# Altium schematic sheet PM12_CONN.SchDoc: FIT_PM12 board
size 420 x 297 mm; CheckedBy: G.Kasprowicz; Author: INR Moscow; CompanyName: WUT ISE; DrawnBy: M.Podgórski; Organization: WUT ISE; Address1: PW ISE; Address2: Nowowiejska 15/19 00-665 Warsaw; Address3: gkasprow@gmail.com; DocumentNumber: 13; Revision: 2; SheetNumber: 4; SheetTotal: 34; ModifiedBy: -; CheckedDate: -; Title2: Serial, SFP; DivGrp: WUT ISE; Designer: INR RAS; ModifiedDate: -; ProjectName: Sensor Box
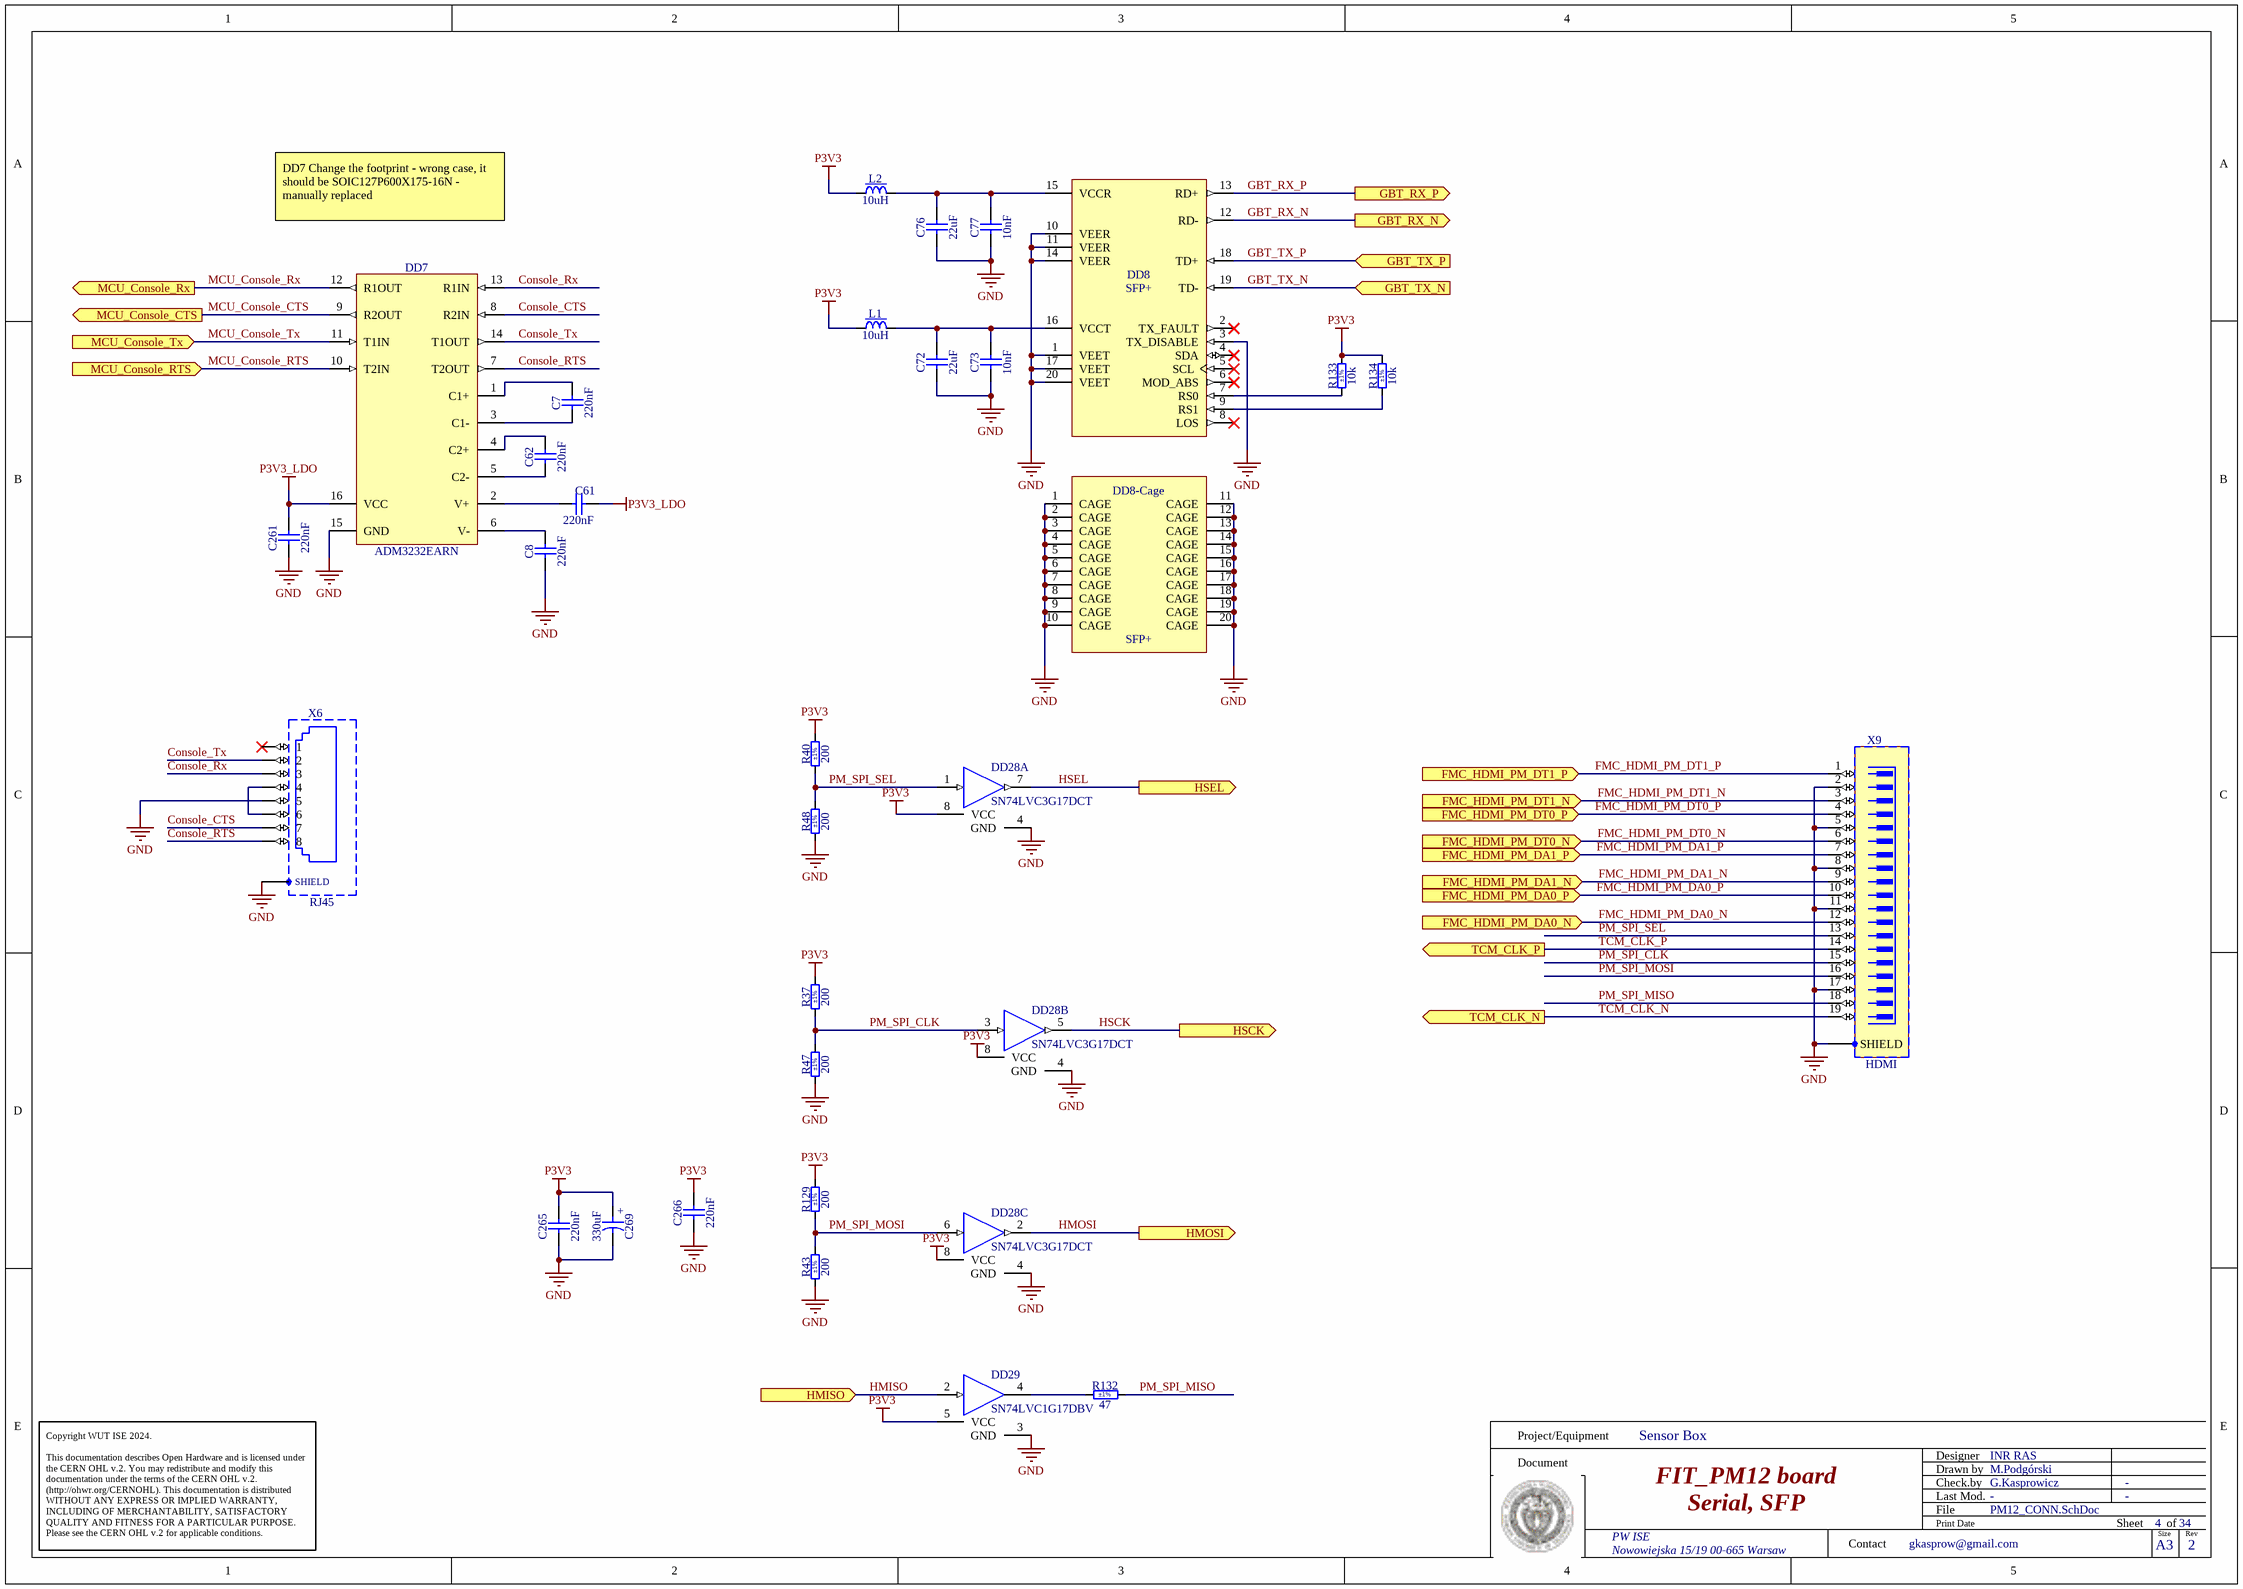
[diagram p0: PM12_CONN.SchDoc]

## Parts
C7  220nF  [CAPC2012X135N]
C8  220nF  [CAPC2012X135N]
C61  220nF  [CAPC2012X135N]
C62  220nF  [CAPC2012X135N]
C72  22uF  [CAPC3216X180N]
C73  10nF  [CAPC2012X135N]
C76  22uF  [CAPC3216X180N]
C77  10nF  [CAPC2012X135N]
C261  220nF  [CAPC2012X135N]
C265  220nF  [CAPC2012X135N]
C266  220nF  [CAPC2012X135N]
C269  330uF  [CAPMP7343X310N]
DD7  ADM3232EARN  [SOIC127P600X175-16N]
DD8  SFP+  [AMPHENOL_UE76A203000]
DD8-Cage  SFP+  [AMPHENOL_U77A16131001]
DD28  SN74LVC3G17DCT  [SOP65P400X130-8N]  (parts A,B,C of 3)
DD29  SN74LVC1G17DBV  [SOT95P280X145-5N]
L1  10uH  [INDM5552X200N]
L2  10uH  [INDM5552X200N]
R37  200  Tolerance: ±1%  [RESC2012X60N]
R40  200  Tolerance: ±1%  [RESC2012X60N]
R43  200  Tolerance: ±1%  [RESC2012X60N]
R47  200  Tolerance: ±1%  [RESC2012X60N]
R48  200  Tolerance: ±1%  [RESC2012X60N]
R129  200  Tolerance: ±1%  [RESC2012X60N]
R132  47  Tolerance: ±1%  [RESC2012X60N]
R133  10k  Tolerance: ±1%  [RESC2012X60N]
R134  10k  Tolerance: ±1%  [RESC2012X60N]
X6  RJ45  [AMPHENOL_RJLSE4238101]
X9  HDMI  [MOLEX_47151-0001]

## Ports
FMC_HDMI_PM_DA0_N (in), FMC_HDMI_PM_DA0_P (in), FMC_HDMI_PM_DA1_N (in), FMC_HDMI_PM_DA1_P (in), FMC_HDMI_PM_DT0_N (in), FMC_HDMI_PM_DT0_P (in), FMC_HDMI_PM_DT1_N (in), FMC_HDMI_PM_DT1_P (in), GBT_RX_N (out), GBT_RX_P (out), GBT_TX_N (in), GBT_TX_P (in), HMISO (in), HMOSI (out), HSCK (out), HSEL (out), MCU_Console_CTS (out), MCU_Console_RTS (in), MCU_Console_Rx (out), MCU_Console_Tx (in), TCM_CLK_N (out), TCM_CLK_P (out)

## Nets
GND: C8.1 C72.1 C73.1 C76.1 C77.1 C261.1 C265.1 C266.1 C269.2 DD7.15(GND) DD8.1(VEET) DD8.3(TX_DISABLE) DD8.10(VEER) DD8.11(VEER) DD8.14(VEER) DD8.17(VEET) DD8.20(VEET) DD8-Cage.1(CAGE) DD8-Cage.2(CAGE) DD8-Cage.3(CAGE) DD8-Cage.4(CAGE) DD8-Cage.5(CAGE) DD8-Cage.6(CAGE) DD8-Cage.7(CAGE) DD8-Cage.8(CAGE) DD8-Cage.9(CAGE) DD8-Cage.10(CAGE) DD8-Cage.11(CAGE) DD8-Cage.12(CAGE) DD8-Cage.13(CAGE) DD8-Cage.14(CAGE) DD8-Cage.15(CAGE) DD8-Cage.16(CAGE) DD8-Cage.17(CAGE) DD8-Cage.18(CAGE) DD8-Cage.19(CAGE) DD8-Cage.20(CAGE) DD28.4(GND) DD29.3(GND) R43.1 R47.1 R48.1 X6.5 X6.SHIELD X9.2 X9.5 X9.8 X9.11 X9.17 X9.SHIELD
P3V3: C265.2 C266.2 C269.1 DD28.8(VCC) DD29.5(VCC) L1.1 L2.1 R37.2 R40.2 R129.2 R133.2 R134.2
P3V3_LDO: C61.2 C261.2 DD7.16(VCC)
Console_CTS: DD7.8(R2IN) X6.7
Console_RTS: DD7.7(T2OUT) X6.8
Console_Rx: DD7.13(R1IN) X6.3
Console_Tx: DD7.14(T1OUT) X6.2
FMC_HDMI_PM_DA0_N: X9.12 ; port FMC_HDMI_PM_DA0_N
FMC_HDMI_PM_DA0_P: X9.10 ; port FMC_HDMI_PM_DA0_P
FMC_HDMI_PM_DA1_N: X9.9 ; port FMC_HDMI_PM_DA1_N
FMC_HDMI_PM_DA1_P: X9.7 ; port FMC_HDMI_PM_DA1_P
FMC_HDMI_PM_DT0_N: X9.6 ; port FMC_HDMI_PM_DT0_N
FMC_HDMI_PM_DT0_P: X9.4 ; port FMC_HDMI_PM_DT0_P
FMC_HDMI_PM_DT1_N: X9.3 ; port FMC_HDMI_PM_DT1_N
FMC_HDMI_PM_DT1_P: X9.1 ; port FMC_HDMI_PM_DT1_P
GBT_RX_N: DD8.12(RD-) ; port GBT_RX_N
GBT_RX_P: DD8.13(RD+) ; port GBT_RX_P
GBT_TX_N: DD8.19(TD-) ; port GBT_TX_N
GBT_TX_P: DD8.18(TD+) ; port GBT_TX_P
HMISO: DD29.2(IN) ; port HMISO
HMOSI: DD28.2(OUT) ; port HMOSI
HSCK: DD28.5(OUT) ; port HSCK
HSEL: DD28.7(OUT) ; port HSEL
MCU_Console_CTS: DD7.9(R2OUT) ; port MCU_Console_CTS
MCU_Console_RTS: DD7.10(T2IN) ; port MCU_Console_RTS
MCU_Console_Rx: DD7.12(R1OUT) ; port MCU_Console_Rx
MCU_Console_Tx: DD7.11(T1IN) ; port MCU_Console_Tx
PM_SPI_CLK: DD28.3(IN) R37.1 R47.2 X9.15
PM_SPI_MISO: R132.2 X9.18
PM_SPI_MOSI: DD28.6(IN) R43.2 R129.1 X9.16
PM_SPI_SEL: DD28.1(IN) R40.1 R48.2 X9.13
TCM_CLK_N: X9.19 ; port TCM_CLK_N
TCM_CLK_P: X9.14 ; port TCM_CLK_P
NetC7_1: C7.1 DD7.3(C1-)
NetC7_2: C7.2 DD7.1(C1+)
NetC8_2: C8.2 DD7.6(V-)
NetC61_1: C61.1 DD7.2(V+)
NetC62_1: C62.1 DD7.5(C2-)
NetC62_2: C62.2 DD7.4(C2+)
NetC72_2: C72.2 C73.2 DD8.16(VCCT) L1.2
NetC76_2: C76.2 C77.2 DD8.15(VCCR) L2.2
NetDD8_7: DD8.7(RS0) R133.1
NetDD8_9: DD8.9(RS1) R134.1
NetDD29_4: DD29.4(OUT) R132.1
NetX6_4: X6.4 X6.6

Not connected (* = marked no-connect by the designer): DD8 2(TX_FAULT)* 4(SDA)* 5(SCL)* 6(MOD_ABS)* 8(LOS)*; X6 1*

## Notes on the sheet
- DD7 Change the footprint - wrong case, it should be SOIC127P600X175-16N - manually replaced
- Project/Equipment
- Document
- Designer
- Drawn by
- Check.by
- Copyright WUT ISE 2024.
  This documentation describes Open Hardware and is licensed under the CERN OHL v.2. You may redistribute and modify this documentation under the terms of the CERN OHL v.2. (http://ohwr.org/CERNOHL). This documentation is distributed WITHOUT ANY EXPRESS OR IMPLIED WARRANTY, INCLUDING OF MERCHANTABILITY, SATISFACTORY QUALITY AND FITNESS FOR A PARTICULAR PURPOSE. Please see the CERN OHL v.2 for applicable conditions.
- Contact
- File
- Last Mod.
- Print Date
- Sheet
- Size
- A3
- of
- Rev
- (in symbol CTE7343-31_330UF_6.3V_20%_LESR0015_KEMET_T520) +

## Library data of the parts
C7 C8 C61 C62 C261 C265 C266 = CC0805_220NF_50V_10%_X7R: Non-polarised capacitor; Part Description: SMD Multilayer Chip Ceramic Capacitor; Manufacturer: GENERIC; Manufacturer1 Part Number: GRM21BR71H224KA01L; Voltage: 50V; TC: X7R; Tolerance: ±10%; Part Number: CC0805_220NF_50V_10%_X7R; Component Kind: Standard; Component Type: Standard; Pin Count: 2; Value: 220nF; Status: Preferred; Manufacturer Part Number: CC0805_220NF_50V_10%_X7R; Case: 0805; Mounted: Yes; Socket: No; SMD: Yes; Sense: No; Manufacturer1 Example: MURATA; Manufacturer1 ComponentHeight: 1.35mm; HelpURL: \\cern.ch\dfs\Applications\Altium\Datasheets\CC0805_X7R_MURATA.pdf; Author: CERN DEM JLC; CreateDate: 03.12.2007; LatestRevisionDate: 03.12.2007
C72 C76 = CC1206_22UF_25V_20%_X5R: Non-polarised capacitor; Part Description: SMD Multilayer Chip Ceramic Capacitor; Manufacturer: GENERIC; Manufacturer1 Part Number: C3216X5R1E226M160; Voltage: 25V; TC: X5R; Tolerance: ±20%; Part Number: CC1206_22UF_25V_20%_X5R; Component Kind: Standard; Component Type: Standard; Pin Count: 2; Value: 22uF; Status: None; Manufacturer Part Number: CC1206_22UF_25V_20%_X5R; Case: 1206; Mounted: Yes; Socket: No; SMD: Yes; Sense: No; Manufacturer1 Example: TDK; Manufacturer1 ComponentHeight: 1.8mm; HelpURL: \\cern.ch\dfs\Applications\Altium\Datasheets\CC1206_X5R_TDK_C.pdf; Author: CERN DEM WB; CreateDate: 25.07.2018; LatestRevisionDate: 25.07.2018
C73 C77 = CC0805_10NF_50V_10%_X7R: Non-polarised capacitor; Part Description: SMD Multilayer Chip Ceramic Capacitor; Manufacturer: GENERIC; Manufacturer1 Part Number: C0805C103K5RACTU; Voltage: 50V; TC: X7R; Tolerance: ±10%; Part Number: CC0805_10NF_50V_10%_X7R; Component Kind: Standard; Component Type: Standard; Pin Count: 2; Value: 10nF; Status: Preferred; Manufacturer Part Number: CC0805_10NF_50V_10%_X7R; Case: 0805; Mounted: Yes; Socket: No; SMD: Yes; Sense: No; Manufacturer1 Example: KEMET; Manufacturer1 ComponentHeight: 0.88mm; HelpURL: \\cern.ch\dfs\Applications\Altium\Datasheets\CC0805_X7R_KEMET.pdf; Author: CERN DEM JLC; CreateDate: 03.12.2007; LatestRevisionDate: 22.04.2015
C269 = CTE7343-31_330UF_6.3V_20%_LESR0015_KEMET_T520: Polarised capacitor; Part Description: Low ESR 0R015 Tantalum Chip Capacitor; Manufacturer: KEMET; Manufacturer Part Number: T520D337M006ATE015; Voltage: 6.3V; Tolerance: ±20%; Part Number: CTE7343-31_330UF_6.3V_20%_LESR0015_KEMET_T520; Component Kind: Standard; Component Type: Standard; Pin Count: 2; Value: 330uF; Status: None; Case: D; Mounted: Yes; Socket: No; SMD: Yes; Sense: No; ComponentHeight: 3.1mm; HelpURL: \\cern.ch\dfs\Applications\Altium\Datasheets\CTE-LESR_KEMET_T520.pdf; Author: CERN DEM JLC; CreateDate: 11.01.2012; LatestRevisionDate: 11.01.2012
DD7 = ADM3232EARN: ±15 kV ESD Protected, 3.3 V, RS-232 Line Driver/Receiver; Manufacturer: ANALOG DEVICES; PressFit: No; Bonding: No; Part Number: ADM3232EARN; Component Kind: Standard; Component Type: Standard; Device: ADM3232EARN; Footprint: SOIC127P1032X265-16N; PackageDescription: SOIC, 1.27mm Pitch; 16 pin, 7.50mm W X 10.4mm L X 2.65mm H body, IPC Medium Density; Part Description: ±15 kV ESD Protected, 3.3 V, RS-232 Line Driver/Receiver; Manufacturer Part Number: ADM3232EARN; Pin Count: 16; Case: SOIC16; Mounted: Yes; Socket: No; SMD: Yes; Sense: No; ComponentHeight: 2.65mm; Author: CERN DEM HF; HelpURL: \\cern.ch\dfs\Applications\Altium\Datasheets\ADM3232EARN.pdf; CreateDate: 24.05.2024; LatestRevisionDate: 24.05.2024
DD8 = AMPHENOL_UE76A203000: 20 Position SFP+ Connector (Small Form-factor Pluggable); Part Description: 20 Position, Pitch 0.8mm SFP+ High Speed Connector Receptacle (Small Form-factor Pluggable); PressFit: No; Part Number: AMPHENOL_UE76A203000; Component Kind: Standard; Component Type: Standard; Pin Count: 20; Family: SFP+; Mounted: Yes; Socket: No; SMD: Yes; Sense: No; Status: None; Manufacturer: AMPHENOL; Manufacturer Part Number: UE76A203000; ComponentHeight: 5.25mm; HelpURL: \\cern.ch\dfs\Applications\Altium\Datasheets\AMPHENOL_UE76A203000.pdf; Author: CERN DEM BC; CreateDate: 04.09.2020; LatestRevisionDate: 04.09.2020
DD8-Cage = AMPHENOL_U77A16131001: SFP+ 1x1 Cage (20Pins); Part Description: 1x1 Cage For Use with SFP+ Connector (Small Form-factor Pluggable); PressFit: No; Part Number: AMPHENOL_U77A16131001; Component Kind: Standard; Component Type: Standard; Pin Count: 20; Family: SFP+; Mounted: Yes; Socket: No; SMD: No; Sense: No; Status: None; Manufacturer: AMPHENOL; Manufacturer Part Number: U77A16131001; ComponentHeight: 9.7mm; HelpURL: \\cern.ch\dfs\Applications\Altium\Datasheets\AMPHENOL_U77A16131001.pdf; Author: CERN DEM BC; CreateDate: 03.09.2020; LatestRevisionDate: 03.09.2020
DD28 = SN74LVC3G17DCT: Triple Schmitt-Trigger Buffer; Manufacturer: TEXAS INSTRUMENTS; PressFit: No; Bonding: No; Part Number: SN74LVC3G17DCT; Component Kind: Standard; Component Type: Standard; Device: SN74LVC3G17DCT; PackageDescription: SOP, 0.65mm Pitch; 8 Pin, 2.80mm W X 2.95mm L X 1.30mm H body, IPC Medium Density; Part Description: Triple Schmitt-Trigger Buffer; Manufacturer Part Number: SN74LVC3G17DCT; Pin Count: 8; Case: TSSOP8; Mounted: Yes; Socket: No; SMD: Yes; Sense: No; ComponentHeight: 1.3mm; Author: CERN DEM HF; HelpURL: \\cern.ch\dfs\Applications\Altium\Datasheets\SN74LVC3G17.pdf; CreateDate: 10.06.2024; LatestRevisionDate: 10.06.2024
DD29 = SN74LVC1G17DBVR: Single Schmitt-Trigger Buffer; Manufacturer: TEXAS INSTRUMENTS; PressFit: No; Bonding: No; Part Number: SN74LVC1G17DBVR; Component Kind: Standard; Component Type: Standard; Device: SN74LVC1G17DBV; PackageDescription: SOT, 0.95mm Pitch; 5 Pin, 1.60mm W X 2.90mm L X 1.45mm H body, IPC Medium Density; Part Description: Single Schmitt-Trigger Buffer; Manufacturer Part Number: SN74LVC1G17DBV; Pin Count: 5; Case: SOT23-5; Mounted: Yes; Socket: No; SMD: Yes; Sense: No; ComponentHeight: 1.45mm; Author: CERN DEM JLC; HelpURL: \\cern.ch\dfs\Applications\Altium\Datasheets\SN74LVC1G17DBVR.pdf; CreateDate: 06.11.2012; LatestRevisionDate: 06.11.2012
L1 L2 = IND2020_10UH_20%_VISHAY_IHLP-2020BZ-11: Inductor With Core; Part Description: Low Profile, High Current IHLP® Inductor; Manufacturer: VISHAY DALE; Manufacturer Part Number: IHLP2020BZER100M11; Power: 2.2A; Resistance: 0.1828R; Tolerance: ±20%; Part Number: IND2020_10UH_20%_VISHAY_IHLP-2020BZ-11; Component Kind: Standard; Component Type: Standard; Pin Count: 2; Value: 10uH; Case: 2020; Mounted: Yes; Socket: No; SMD: Yes; Sense: No; ComponentHeight: 2mm; HelpURL: \\cern.ch\dfs\Applications\Altium\Datasheets\IND2020_VISHAY_IHLP2020BZ-11.pdf; Author: CERN DEM HF; CreateDate: 31.05.2024; LatestRevisionDate: 31.05.2024
R37 R40 R43 R47 R48 R129 = R0805_200R_1%_0.125W_100PPM: Resistor - 1%; Part Description: General Purpose Thick Film Chip Resistor; Manufacturer: GENERIC; Manufacturer1 Part Number: NRC10F2000TRF; Power: 0.125W; TC: ±100ppm/°C; PressFit: No; Part Number: R0805_200R_1%_0.125W_100PPM; Component Kind: Standard; Component Type: Standard; Pin Count: 2; Value: 200; Status: Preferred; Manufacturer Part Number: R0805_200R_1%_0.125W_100PPM; Case: 0805; Mounted: Yes; Sense: No; Socket: No; SMD: Yes; Manufacturer1 Example: NIC COMPONENT; Manufacturer1 ComponentHeight: 0.6mm; HelpURL: \\cern.ch\dfs\Applications\Altium\Datasheets\R0805_NIC_NRC.pdf; Author: CERN DEM JLC; CreateDate: 03.12.2007; LatestRevisionDate: 13.03.2008
R132 = R0805_47R_1%_0.125W_100PPM: Resistor - 1%; Part Description: General Purpose Thick Film Chip Resistor; Manufacturer: GENERIC; Manufacturer1 Part Number: NRC10F47R0TRF; Power: 0.125W; TC: ±100ppm/°C; PressFit: No; Part Number: R0805_47R_1%_0.125W_100PPM; Component Kind: Standard; Component Type: Standard; Pin Count: 2; Value: 47; Status: Preferred; Manufacturer Part Number: R0805_47R_1%_0.125W_100PPM; Case: 0805; Mounted: Yes; Sense: No; Socket: No; SMD: Yes; Manufacturer1 Example: NIC COMPONENT; Manufacturer1 ComponentHeight: 0.6mm; HelpURL: \\cern.ch\dfs\Applications\Altium\Datasheets\R0805_NIC_NRC.pdf; Author: CERN DEM JLC; CreateDate: 03.12.2007; LatestRevisionDate: 13.03.2008
R133 R134 = R0805_10K_1%_0.125W_100PPM: Resistor - 1%; Part Description: General Purpose Thick Film Chip Resistor; Manufacturer: GENERIC; Manufacturer1 Part Number: NRC10F1002TRF; Power: 0.125W; TC: ±100ppm/°C; PressFit: No; Part Number: R0805_10K_1%_0.125W_100PPM; Component Kind: Standard; Component Type: Standard; Pin Count: 2; Value: 10k; Status: Preferred; Manufacturer Part Number: R0805_10K_1%_0.125W_100PPM; Case: 0805; Mounted: Yes; Sense: No; Socket: No; SMD: Yes; Manufacturer1 Example: NIC COMPONENT; Manufacturer1 ComponentHeight: 0.6mm; HelpURL: \\cern.ch\dfs\Applications\Altium\Datasheets\R0805_NIC_NRC.pdf; Author: CERN DEM JLC; CreateDate: 03.12.2007; LatestRevisionDate: 13.03.2008
X6 = AMPHENOL_RJLSE4238101: Connector RJ45 + Shield; Part Description: 1 Port RJ45 Connector, 8P8C ,  Right Angle Without Leds; PressFit: No; Part Number: AMPHENOL_RJLSE4238101; Component Kind: Standard; Component Type: Standard; Pin Count: 9; Family: RJ45; Mounted: Yes; Socket: No; SMD: No; Sense: No; Status: None; Manufacturer: AMPHENOL; Manufacturer Part Number: RJLSE4238101; ComponentHeight: 11.85mm; HelpURL: \\cern.ch\dfs\Applications\Altium\Datasheets\AMPHENOL_RJLSE4238101.pdf; Author: CERN DEM HF; CreateDate: 07.06.2024; LatestRevisionDate: 07.06.2024
X9 = MOLEX_47151-0001: Connector HDMI 19 Male + 1 Shield; Part Description: 0.5mm Pitch, Surface Mount Right Angle 19 Contacts HDMI Receptacle with Thru Hole Mounting Pads; Manufacturer: MOLEX; PressFit: No; Part Number: MOLEX_47151-0001; Component Kind: Standard; Component Type: Standard; Pin Count: 20; Family: HDMI; Mounted: Yes; Socket: No; SMD: Yes; Sense: No; Status: None; Manufacturer Part Number: 47151-0001; ComponentHeight: 6.18mm; HelpURL: \\cern.ch\dfs\Applications\Altium\Datasheets\MOLEX_47151-0001.pdf; Author: CERN DEM JLC; CreateDate: 23.02.2015; LatestRevisionDate: 23.02.2015